# Altium schematic sheet PCAL9555IO.SchDoc
size A3; SheetNumber: 3; SheetTotal: 3
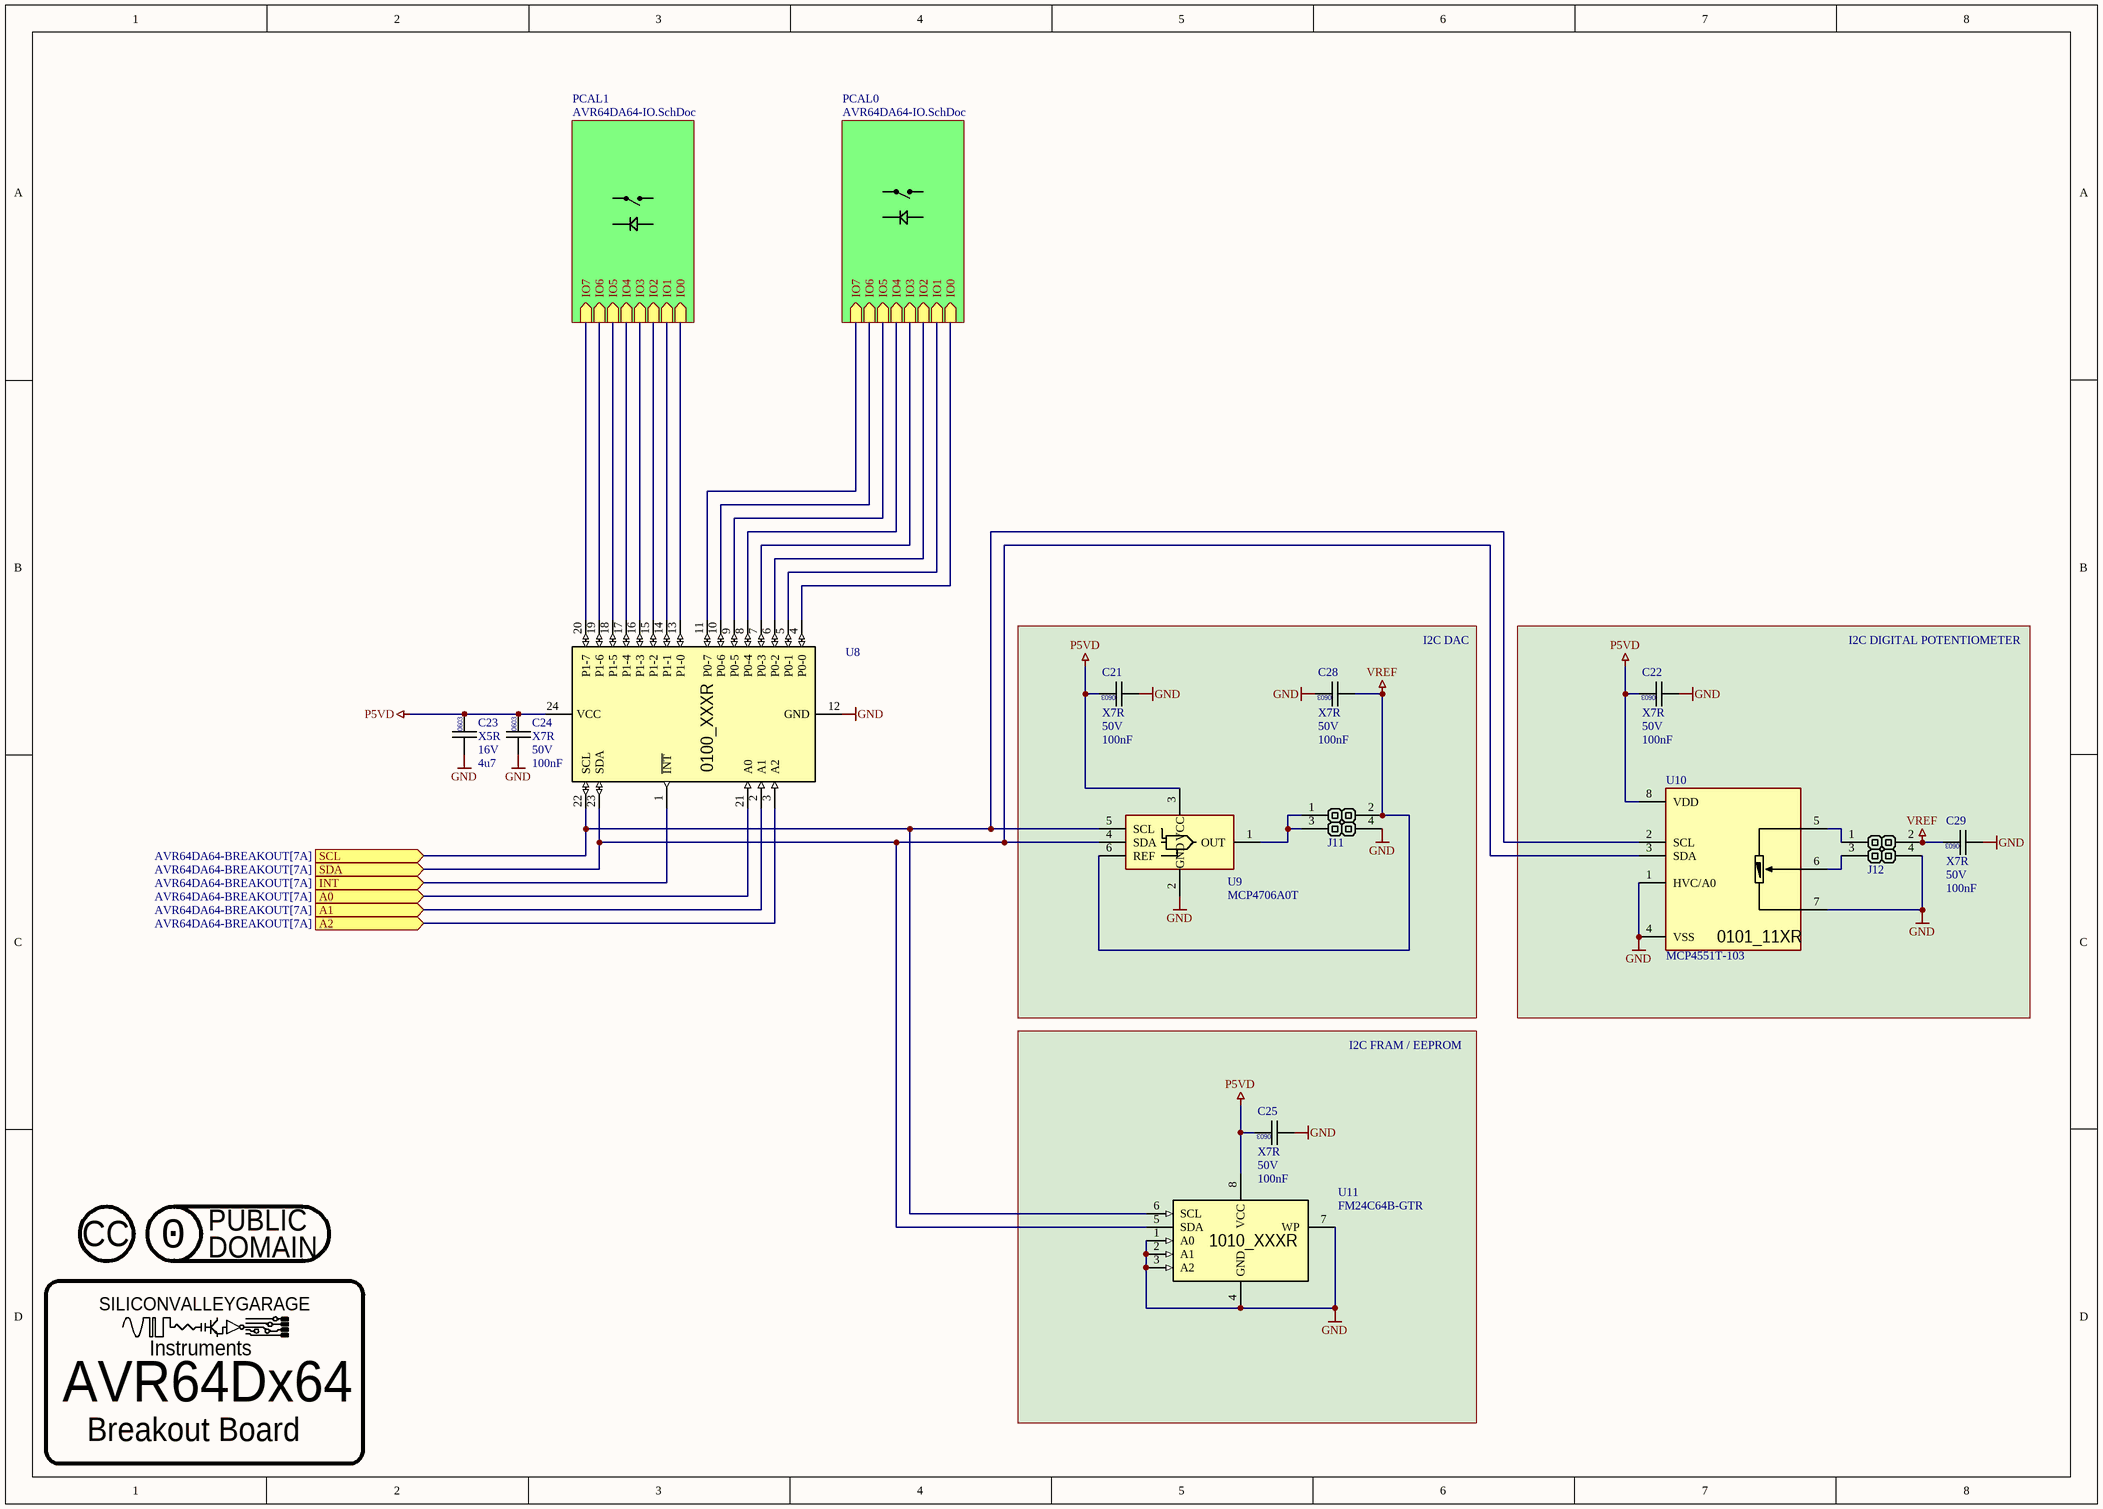
[diagram p0: PCAL9555IO.SchDoc]

## Parts
(Parts that share a designator on the sheet are numbered #1, #2 ... from top to bottom, then left to right.)
C21  Dielectric: X7R  Voltage: 50V  Capacitance: 100nF  [CAPC0603]  (hidden comment: CAP0603)
C22  Dielectric: X7R  Voltage: 50V  Capacitance: 100nF  [CAPC0603]  (hidden comment: CAP0603)
C23  Dielectric: X5R  Voltage: 16V  Capacitance: 4u7  [CAPC0603]  (hidden comment: CAP0603)
C24  Dielectric: X7R  Voltage: 50V  Capacitance: 100nF  [CAPC0603]  (hidden comment: CAP0603)
C25  Dielectric: X7R  Voltage: 50V  Capacitance: 100nF  [CAPC0603]  (hidden comment: CAP0603)
C28  Dielectric: X7R  Voltage: 50V  Capacitance: 100nF  [CAPC0603]  (hidden comment: CAP0603)
C29  Dielectric: X7R  Voltage: 50V  Capacitance: 100nF  [CAPC0603]  (hidden comment: CAP0603)
J11  BOXHEADER-2x2  [CONNECTOR-GENERIC-PINHEADER-2X2]  (value not drawn)
J12  BOXHEADER-2x2  [CONNECTOR-GENERIC-PINHEADER-2X2]  (value not drawn)
LOGO?#1  LOGO-LICENSE-CC  [LOGO-LICENSE-CC]  (value not drawn)  (no BOM)
LOGO?#2  LOGO-LICENSE-CC0-PUBLIC  [LOGO-LICENSE-CC0-PUBLIC]  (value not drawn)  (no BOM)
LOGO?#3  LOGO-SILICONVALLEYGARAGE-SMALL  [SILICONVALLEYGARAGE]  (value not drawn)  (graphical)
U8  PCAL9555  [SO65P640X120-24N]  (value not drawn)
U9  MCP4706A0T  [sot23-6]
U10  MCP4551T-103  [SO65P490-8N]
U11  FM24C64B-GTR  [SO127P600-8N]

## Blocks framed on the sheet
I2C DAC: C21 C28 J11 U9
I2C DIGITAL POTENTIOMETER: C22 C29 J12 U10
I2C FRAM / EEPROM: C25 U11
AVR64Dx64: LOGO?#3

## Sub-sheets
PCAL0 = AVR64DA64-IO.SchDoc: IO0 (in), IO1 (in), IO2 (in), IO3 (in), IO4 (in), IO5 (in), IO6 (in), IO7 (in)
PCAL1 = AVR64DA64-IO.SchDoc: IO0 (in), IO1 (in), IO2 (in), IO3 (in), IO4 (in), IO5 (in), IO6 (in), IO7 (in)

## Ports
A0 (in, see AVR64DA64-BREAKOUT[7A]), A1 (in, see AVR64DA64-BREAKOUT[7A]), A2 (in, see AVR64DA64-BREAKOUT[7A]), INT (in, see AVR64DA64-BREAKOUT[7A]), SCL (in, see AVR64DA64-BREAKOUT[7A]), SDA (in, see AVR64DA64-BREAKOUT[7A])

## Nets
GND: C21.2 C22.2 C23.2 C24.2 C25.2 C28.1 C29.2 J11.4(-) J12.4(-) U8.12(GND) U9.2(GND) U10.1(HVC/A0) U10.4(VSS) U10.7(POB) U11.1(A0) U11.2(A1) U11.3(A2) U11.4(GND) U11.7(WP)
P5VD: C21.1 C22.1 C23.1 C24.1 C25.1 U8.24(VCC) U9.3(VCC) U10.8(VDD) U11.8(VCC)
VREF: C28.2 C29.1 J11.2(-) J12.2(-) U9.6(REF)
A0: U8.21(A0) ; port A0
A1: U8.2(A1) ; port A1
A2: U8.3(A2) ; port A2
INT: U8.1(~{INT}) ; port INT
SCL: U8.22(SCL) U9.5(SCL) U10.2(SCL) U11.6(SCL) ; port SCL
SDA: U8.23(SDA) U9.4(SDA) U10.3(SDA) U11.5(SDA) ; port SDA
NetJ11_1: J11.1(+) J11.3(-) U9.1(OUT)
NetJ12_1: J12.1(+) U10.5(POA)
NetJ12_3: J12.3(-) U10.6(OW)
NetU8_4: U8.4(P0-0) ; sheet PCAL0/IO0
NetU8_5: U8.5(P0-1) ; sheet PCAL0/IO1
NetU8_6: U8.6(P0-2) ; sheet PCAL0/IO2
NetU8_7: U8.7(P0-3) ; sheet PCAL0/IO3
NetU8_8: U8.8(P0-4) ; sheet PCAL0/IO4
NetU8_9: U8.9(P0-5) ; sheet PCAL0/IO5
NetU8_10: U8.10(P0-6) ; sheet PCAL0/IO6
NetU8_11: U8.11(P0-7) ; sheet PCAL0/IO7
NetU8_13: U8.13(P1-0) ; sheet PCAL1/IO0
NetU8_14: U8.14(P1-1) ; sheet PCAL1/IO1
NetU8_15: U8.15(P1-2) ; sheet PCAL1/IO2
NetU8_16: U8.16(P1-3) ; sheet PCAL1/IO3
NetU8_17: U8.17(P1-4) ; sheet PCAL1/IO4
NetU8_18: U8.18(P1-5) ; sheet PCAL1/IO5
NetU8_19: U8.19(P1-6) ; sheet PCAL1/IO6
NetU8_20: U8.20(P1-7) ; sheet PCAL1/IO7

## Notes on the sheet
- (near LOGO?#3) Instruments
- Breakout Board
- (in symbol IC-INFINEON-FM24C64B-GTR) 1010_XXXR
- (in symbol IC-MICROCHIP-MCP4551T-103) 0101_11XR
- (in symbol IC-NEXPERIA-PCAL9555A) 0100_XXXR
- (in symbol LOGO-LICENSE-CC) CC
- (in symbol LOGO-LICENSE-CC0-PUBLIC) PUBLIC; 0; DOMAIN
- (in symbol LOGO-SILICONVALLEYGARAGE-SMALL) SILICONVALLEYGARAGE

## Library data of the parts
C21 C22 C24 C25 C28 C29 = CAPC-0603-100nF-50V-X7R: CAPACITOR,CERAMIC,100nF,50V,X7R,0603; Manufacturer 1: KEMET; Manufacturer Part Number 1: C0603C104K5RACTU; Package / Case: 0603; Location: *; LCSC: C14663; MOUSER: 80-C0603C104K5R
C23 = CAPC-0603-4u7-10V-X5R_1: CAPACITOR,CERAMIC,4u7,16V,X5R,0603; Package / Case: 0603; Location: *; LCSC: C19666
J11 J12 = CONN-HEADER-MALE-2X2: CONN,HEADER,2X2,2.54mm; LCSC: C5383103
LOGO?#3 = LOGO-SILICONVALLEYGARAGE-SMALL: LOGO,SILICONVALLEYGARAGE,SMALL
U8 = IC-NEXPERIA-PCAL9555A: I2C,16BIT AGILE I/O EXPANDER,INT,NEXPERIA,PCAL95555,TSSOP24; Manufacturer Part Number 1: PCAL9555APW,118; DIGIKEY: 568-9928-1-ND; LCSC: C2669740; Manufacturer 1: NEXPERIA
U9 = IC-MICROCHIP-MCP4706A0T: IC,DAC,8BIT,I2C; Manufacturer Part Number 1: MCP4706A0T-E/CH; LCSC: C2649360; Manufacturer 1: MICROCHIP
U10 = IC-MICROCHIP-MCP4551T-103: IC,DIGITAL POTMETER,257STEP,I2C,10K,MICROCHIP,MCP4551T-103; Manufacturer Part Number 1: MCP4551T-103E/MS; LCSC: C627285; DIGIKEY: MCP4551T-103E/MSCT-ND; Manufacturer 1: MICROCHIP
U11 = IC-INFINEON-FM24C64B-GTR: IC,FRAM,I2C, 64KBIT; LCSC: C914923; Supplier 1: Arrow Electronics; Supplier Part Number 1: FM24C64B-GTR